# Altium schematic sheet StepperMotor1CTRL.SchDoc: Stepper Motor Driver
size B; Date: 2015-01-23; Author: Marcin Czajkowski; Organization: Marcin Czajkowski; Address1: SN3547684; Address2: ESE-Year2; Address3: Conestoga College; Address4: Project IV; DocumentNumber: 5; Revision: A; SheetNumber: 5; SheetTotal: 14
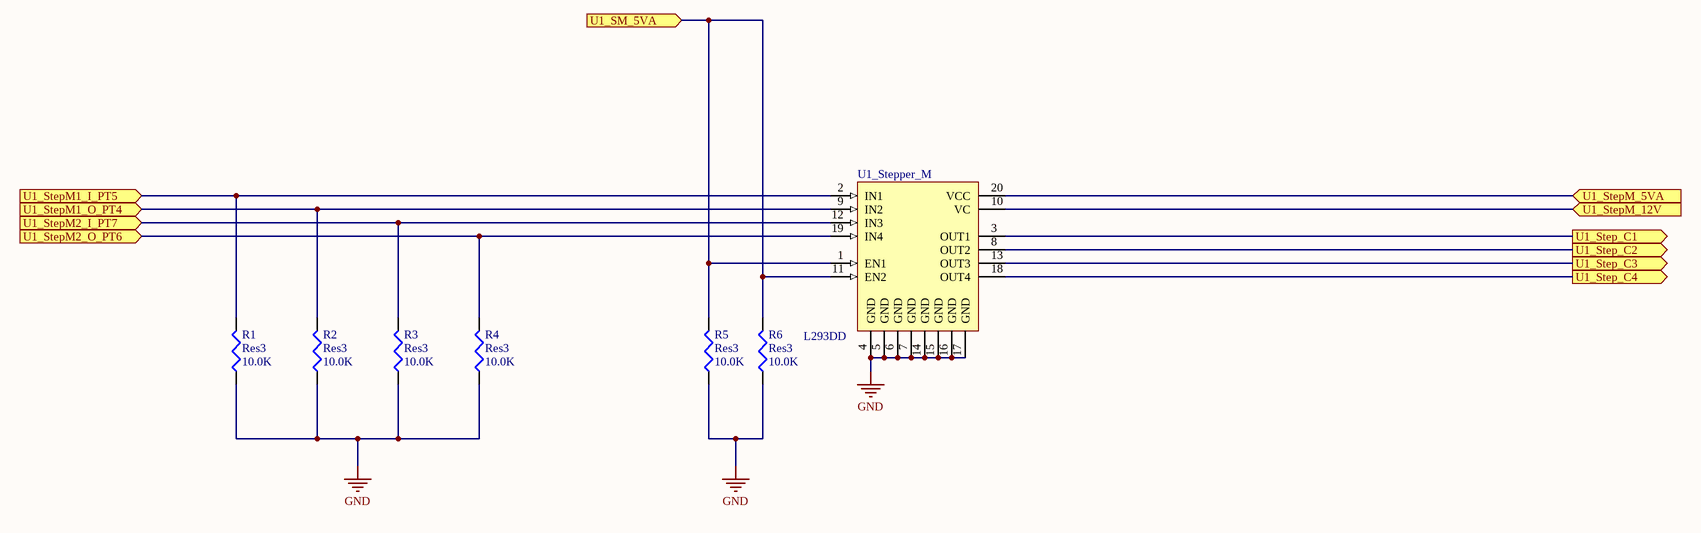
[diagram p0: StepperMotor1CTRL.SchDoc]

## Parts
R1  Res3  value 10.0K  [RESC2112X05M]
R2  Res3  value 10.0K  [RESC2112X05M]
R3  Res3  value 10.0K  [RESC2112X05M]
R4  Res3  value 10.0K  [RESC2112X05M]
R5  Res3  value 10.0K  [RESC2112X05M]
R6  Res3  value 10.0K  [RESC2112X05M]
U1_Stepper_M  L293DD  [SO20_N]

## Ports
U1_SM_5VA (in), U1_Step_C1 (out), U1_Step_C2 (out), U1_Step_C3 (out), U1_Step_C4 (out), U1_StepM1_I_PT5 (in), U1_StepM1_O_PT4 (in), U1_StepM2_I_PT7 (in), U1_StepM2_O_PT6 (in), U1_StepM_5VA (in), U1_StepM_12V (in)

## Nets
GND: R1.1 R2.1 R3.1 R4.1 R5.1 R6.1 U1_Stepper_M.4(GND) U1_Stepper_M.5(GND) U1_Stepper_M.6(GND) U1_Stepper_M.7(GND) U1_Stepper_M.14(GND) U1_Stepper_M.15(GND) U1_Stepper_M.16(GND) U1_Stepper_M.17(GND)
U1_SM_5VA: R5.2 R6.2 U1_Stepper_M.1(EN1) U1_Stepper_M.11(EN2) ; port U1_SM_5VA
U1_Step_C1: U1_Stepper_M.3(OUT1) ; port U1_Step_C1
U1_Step_C2: U1_Stepper_M.8(OUT2) ; port U1_Step_C2
U1_Step_C3: U1_Stepper_M.13(OUT3) ; port U1_Step_C3
U1_Step_C4: U1_Stepper_M.18(OUT4) ; port U1_Step_C4
U1_StepM1_I_PT5: R1.2 U1_Stepper_M.2(IN1) ; port U1_StepM1_I_PT5
U1_StepM1_O_PT4: R2.2 U1_Stepper_M.9(IN2) ; port U1_StepM1_O_PT4
U1_StepM2_I_PT7: R3.2 U1_Stepper_M.12(IN3) ; port U1_StepM2_I_PT7
U1_StepM2_O_PT6: R4.2 U1_Stepper_M.19(IN4) ; port U1_StepM2_O_PT6
U1_StepM_5VA: U1_Stepper_M.20(VCC) ; port U1_StepM_5VA
U1_StepM_12V: U1_Stepper_M.10(VC) ; port U1_StepM_12V

## Notes on the sheet
- ESE
- is the sole property of ESE. Any reproduction
- The Information Contained in this drawing
- Schematic P/N and Name
- Sheet Name
- 299 Doon Valley Drive
- Kitchener, ON N2G 4M4
- Canada
- Approved
- in part or in whole without the written
- permission of ESE is strictly prohibited.
- APPROVALS
- DATE
- Size
- Scale
- B
- NTS
- Bare PCB P/N
- Date
- Sheet
- Rev.
- Checked
- Engineer
- of

## Library data of the parts
R1-R6 = Resistor_10.0K: RES SMD 10.0K OHM 1% 1/8W 0805; MPN: CRCW080510K0FKEA; PN: 541-10.0KCCT-ND; Name: Resistor_10.0K; URL: http://www.digikey.ca/product-detail/en/CRCW080510K0FKEA/541-10.0KCCT-ND
U1_Stepper_M = L293DD: Push-Pull Four Channel Driver With Diode; PN: 497-2937-1-ND; Published: 8-Jun-2000; LatestRevisionDate: 13-Apr-2006; LatestRevisionNote: IPC-7351 Footprint Added.; DatasheetVersion: Jun-1996; PackageVersion: Jul-2001; PackageReference: SO20; Publisher: Altium Limited; PackageDescription: 20-Pin Plastic Small Outline Integrated Circuit 1.27 mm Pitch; Code_JEDEC: MS-013-AC; Code_IPC: SOIC127P1030-20; ComponentLink1Description: Manufacturer Link; ComponentLink1URL: http://www.st.com/; ComponentLink2Description: Datasheet; ComponentLink2URL: http://www.st.com/stonline/products/literature/ds/1330/l293d.pdf; URL: http://www.digikey.ca/product-detail/en/L293DD013TR/497-2937-1-ND/634902